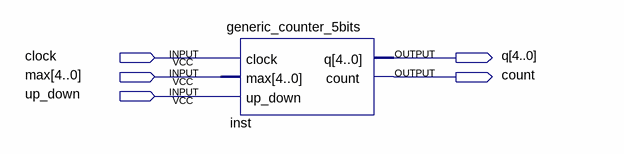
[diagram p0: schematic sheet]
// Quartus schematic generic_counter_5bits_test.bdf as structural Verilog: 1 symbols, 5 pins
module generic_counter_5bits_test (
  input  clock,
  input  [4:0] max,
  input  up_down,
  output [4:0] q,
  output count
);

  generic_counter_5bits inst (.clock(clock), .max(max), .up_down(up_down), .q(q), .count(count));
endmodule
